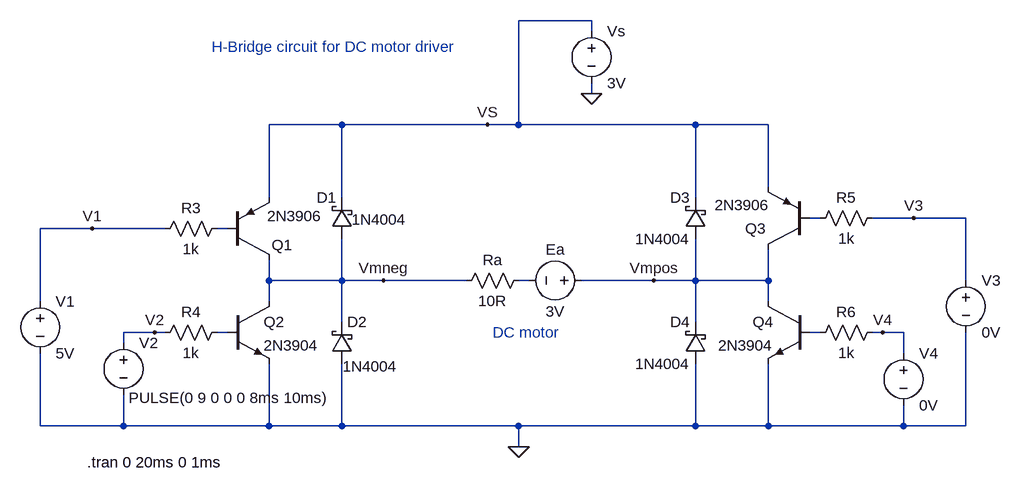
[diagram p0: schematic DCmotordriver.asc]
DCmotordriver.asc, the LTspice schematic file:
Version 4
SHEET 1 1020 680
WIRE 384 -208 272 -208
WIRE 384 -192 384 -208
WIRE 384 -96 384 -112
WIRE 0 -48 -112 -48
WIRE 224 -48 0 -48
WIRE 272 -48 272 -208
WIRE 272 -48 224 -48
WIRE 544 -48 272 -48
WIRE 656 -48 544 -48
WIRE 656 48 656 -48
WIRE -112 64 -112 -48
WIRE 0 64 0 -48
WIRE 544 64 544 -48
WIRE 736 96 720 96
WIRE 880 96 816 96
WIRE 960 96 880 96
WIRE -384 112 -464 112
WIRE -272 112 -384 112
WIRE -176 112 -192 112
WIRE -112 192 -112 160
WIRE 0 192 0 128
WIRE 0 192 -112 192
WIRE 64 192 0 192
WIRE 192 192 64 192
WIRE 288 192 272 192
WIRE 480 192 368 192
WIRE 544 192 544 128
WIRE 544 192 480 192
WIRE 656 192 656 144
WIRE 656 192 544 192
WIRE 960 192 960 96
WIRE -464 224 -464 112
WIRE -112 224 -112 192
WIRE 656 224 656 192
WIRE 0 256 0 192
WIRE 544 256 544 192
WIRE -288 272 -336 272
WIRE -272 272 -288 272
WIRE -176 272 -192 272
WIRE 736 272 720 272
WIRE 832 272 816 272
WIRE 864 272 832 272
WIRE -336 288 -336 272
WIRE 864 304 864 272
WIRE -464 416 -464 304
WIRE -336 416 -336 368
WIRE -336 416 -464 416
WIRE -112 416 -112 320
WIRE -112 416 -336 416
WIRE 0 416 0 320
WIRE 0 416 -112 416
WIRE 272 416 0 416
WIRE 544 416 544 320
WIRE 544 416 272 416
WIRE 656 416 656 320
WIRE 656 416 544 416
WIRE 864 416 864 384
WIRE 864 416 656 416
WIRE 960 416 960 272
WIRE 960 416 864 416
WIRE 272 448 272 416
FLAG 272 448 0
FLAG 384 -96 0
FLAG 224 -48 VS
FLAG 480 192 Vmpos
FLAG 64 192 Vmneg
FLAG -384 112 V1
FLAG -288 272 V2
FLAG 880 96 V3
FLAG 832 272 V4
SYMBOL voltage 384 -208 R0
SYMATTR InstName Vs
SYMATTR Value 3V
SYMBOL npn -176 224 R0
SYMATTR InstName Q2
SYMATTR Value 2N3904
SYMBOL npn 720 224 M0
SYMATTR InstName Q4
SYMATTR Value 2N3904
SYMBOL schottky 16 128 R180
WINDOW 0 24 64 Left 2
WINDOW 3 -84 30 Left 2
SYMATTR InstName D1
SYMATTR Value 1N4004
SYMATTR Description Diode
SYMATTR Type diode
SYMBOL schottky 16 320 R180
WINDOW 0 -23 64 Left 2
WINDOW 3 -70 -4 Left 2
SYMATTR InstName D2
SYMATTR Value 1N4004
SYMATTR Description Diode
SYMATTR Type diode
SYMBOL schottky 560 128 R180
WINDOW 0 24 64 Left 2
WINDOW 3 24 0 Left 2
SYMATTR InstName D3
SYMATTR Value 1N4004
SYMATTR Description Diode
SYMATTR Type diode
SYMBOL schottky 560 320 R180
WINDOW 0 24 64 Left 2
WINDOW 3 24 0 Left 2
SYMATTR InstName D4
SYMATTR Value 1N4004
SYMATTR Description Diode
SYMATTR Type diode
SYMBOL pnp -176 160 M180
WINDOW 0 68 23 Left 2
WINDOW 3 61 67 Left 2
SYMATTR InstName Q1
SYMATTR Value 2N3906
SYMBOL pnp 720 144 R180
WINDOW 0 67 32 Left 2
WINDOW 3 62 68 Left 2
SYMATTR InstName Q3
SYMATTR Value 2N3906
SYMBOL res -288 128 R270
WINDOW 0 32 56 VTop 2
WINDOW 3 0 56 VBottom 2
SYMATTR InstName R3
SYMATTR Value 1k
SYMBOL res -176 256 R90
WINDOW 0 0 56 VBottom 2
WINDOW 3 32 56 VTop 2
SYMATTR InstName R4
SYMATTR Value 1k
SYMBOL res 832 80 R90
WINDOW 0 0 56 VBottom 2
WINDOW 3 32 56 VTop 2
SYMATTR InstName R5
SYMATTR Value 1k
SYMBOL res 720 288 R270
WINDOW 0 32 56 VTop 2
WINDOW 3 0 56 VBottom 2
SYMATTR InstName R6
SYMATTR Value 1k
SYMBOL voltage -464 208 R0
SYMATTR InstName V1
SYMATTR Value 5V
SYMBOL voltage -336 272 R0
WINDOW 123 0 0 Left 2
WINDOW 39 0 0 Left 2
WINDOW 3 8 101 Left 2
SYMATTR Value PULSE(0 9 0 0 0 8ms 10ms)
SYMATTR InstName V2
SYMBOL voltage 960 176 R0
SYMATTR InstName V3
SYMATTR Value 0V
SYMBOL voltage 864 288 R0
SYMATTR InstName V4
SYMATTR Value 0V
SYMBOL res 176 208 R270
WINDOW 0 32 56 VTop 2
WINDOW 3 0 56 VBottom 2
SYMATTR InstName Ra
SYMATTR Value 10R
SYMBOL voltage 384 192 R90
WINDOW 0 -32 56 VBottom 2
WINDOW 3 32 56 VTop 2
SYMATTR InstName Ea
SYMATTR Value 3V
TEXT -392 472 Left 2 !.tran 0 20ms 0 1ms
TEXT 232 272 Left 2 ;DC motor
TEXT -200 -168 Left 2 ;H-Bridge circuit for DC motor driver

The netlist it stands for:
* DCmotordriver.asc
Vs VS 0 3V
Q2 Vmneg N004 0 0 2N3904
Q4 Vmpos N005 0 0 2N3904
D1 Vmneg VS 1N4004
D2 0 Vmneg 1N4004
D3 Vmpos VS 1N4004
D4 0 Vmpos 1N4004
Q1 Vmneg N002 VS 0 2N3906
Q3 Vmpos N001 VS 0 2N3906
R3 V1 N002 1k
R4 N004 V2 1k
R5 V3 N001 1k
R6 N005 V4 1k
V1 V1 0 5V
V2 V2 0 PULSE(0 9 0 0 0 8ms 10ms)
V3 V3 0 0V
V4 V4 0 0V
Ra Vmneg N003 10R
V§Ea Vmpos N003 3V
.model D D
.lib standard.dio
.model NPN NPN
.model PNP PNP
.lib standard.bjt
.tran 0 20ms 0 1ms
* DC motor
* H-Bridge circuit for DC motor driver
.backanno
.end